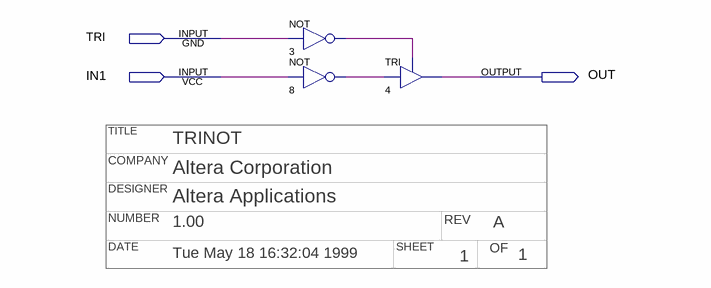
[diagram p0: schematic sheet]
// Quartus schematic trinot.bdf as structural Verilog: 3 symbols, 3 pins
// Title block: TITLE: TRINOT; COMPANY: Altera Corporation; DESIGNER: Altera Applications; NUMBER: 1.00; REV: A; DATE: Tue May 18 16:32:04 1999; SHEET: 1; OF: 1
module trinot (
  input  TRI,
  input  IN1,
  output OUT
);

  wire n3_out, n8_out;

  not u_3 (n3_out, TRI);
  not u_8 (n8_out, IN1);
  TRI u_4 (.IN(n8_out), .OE(n3_out), .OUT(OUT));
endmodule
